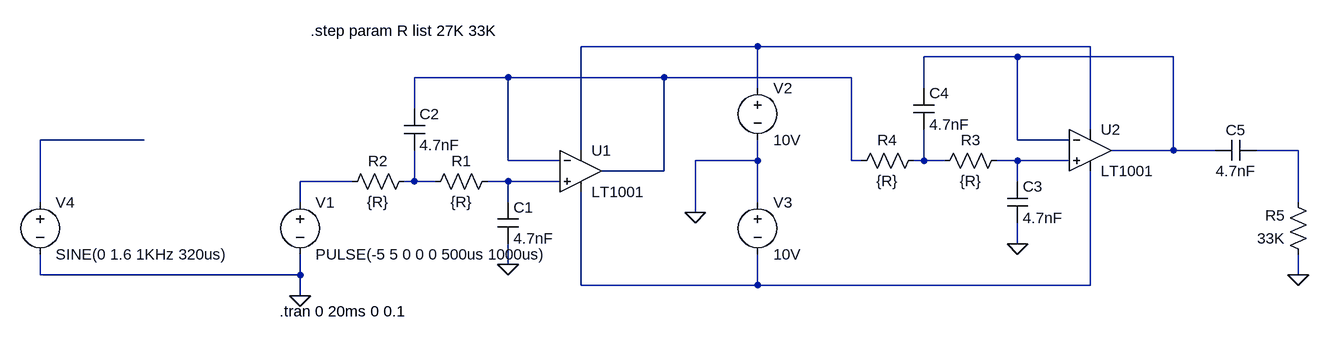
[diagram p0: schematic lpf_4_butterworth.asc]
lpf_4_butterworth.asc, the LTspice schematic file:
Version 4
SHEET 1 1364 680
WIRE 512 -32 240 -32
WIRE 1024 -32 512 -32
WIRE 912 -16 768 -16
WIRE 1152 -16 912 -16
WIRE 128 16 -16 16
WIRE 368 16 128 16
WIRE 656 16 368 16
WIRE 512 32 512 -32
WIRE 768 32 768 -16
WIRE -16 64 -16 16
WIRE 1024 96 1024 -32
WIRE -432 112 -592 112
WIRE 912 112 912 -16
WIRE 992 112 912 112
WIRE 240 128 240 -32
WIRE 1152 128 1152 -16
WIRE 1152 128 1056 128
WIRE 1216 128 1152 128
WIRE 1344 128 1280 128
WIRE 128 144 128 16
WIRE 208 144 128 144
WIRE 512 144 512 112
WIRE 512 144 416 144
WIRE 656 144 656 16
WIRE 672 144 656 144
WIRE 768 144 768 96
WIRE 768 144 752 144
WIRE 800 144 768 144
WIRE 912 144 880 144
WIRE 992 144 912 144
WIRE 368 160 368 16
WIRE 368 160 272 160
WIRE -112 176 -192 176
WIRE -16 176 -16 128
WIRE -16 176 -32 176
WIRE 16 176 -16 176
WIRE 128 176 96 176
WIRE 208 176 128 176
WIRE 912 176 912 144
WIRE -592 208 -592 112
WIRE -192 208 -192 176
WIRE 128 208 128 176
WIRE 512 208 512 144
WIRE 1344 208 1344 128
WIRE 416 224 416 144
WIRE 912 272 912 240
WIRE 128 304 128 272
WIRE -592 320 -592 288
WIRE -192 320 -192 288
WIRE -192 320 -592 320
WIRE 1344 320 1344 288
WIRE 240 336 240 192
WIRE 512 336 512 288
WIRE 512 336 240 336
WIRE 1024 336 1024 160
WIRE 1024 336 512 336
WIRE -192 352 -192 320
FLAG 128 304 0
FLAG -192 352 0
FLAG 416 224 0
FLAG 912 272 0
FLAG 1344 320 0
SYMBOL cap 112 208 R0
SYMATTR InstName C1
SYMATTR Value 4.7nF
SYMBOL res 112 160 R90
WINDOW 0 0 56 VBottom 2
WINDOW 3 32 56 VTop 2
SYMATTR InstName R1
SYMATTR Value {R}
SYMBOL res -16 160 R90
WINDOW 0 0 56 VBottom 2
WINDOW 3 32 56 VTop 2
SYMATTR InstName R2
SYMATTR Value {R}
SYMBOL cap -32 64 R0
SYMATTR InstName C2
SYMATTR Value 4.7nF
SYMBOL voltage -192 192 R0
WINDOW 123 0 0 Left 2
WINDOW 39 0 0 Left 2
SYMATTR InstName V1
SYMATTR Value PULSE(-5 5 0 0 0 500us 1000us)
SYMBOL voltage 512 16 R0
WINDOW 123 0 0 Left 2
WINDOW 39 0 0 Left 2
SYMATTR InstName V2
SYMATTR Value 10V
SYMBOL voltage 512 192 R0
WINDOW 123 0 0 Left 2
WINDOW 39 0 0 Left 2
SYMATTR InstName V3
SYMATTR Value 10V
SYMBOL Opamps\\LT1001 240 96 R0
SYMATTR InstName U1
SYMBOL voltage -592 192 R0
WINDOW 123 0 0 Left 2
WINDOW 39 0 0 Left 2
SYMATTR InstName V4
SYMATTR Value SINE(0 1.6 1KHz 320us)
SYMBOL cap 896 176 R0
SYMATTR InstName C3
SYMATTR Value 4.7nF
SYMBOL res 896 128 R90
WINDOW 0 0 56 VBottom 2
WINDOW 3 32 56 VTop 2
SYMATTR InstName R3
SYMATTR Value {R}
SYMBOL res 768 128 R90
WINDOW 0 0 56 VBottom 2
WINDOW 3 32 56 VTop 2
SYMATTR InstName R4
SYMATTR Value {R}
SYMBOL cap 752 32 R0
SYMATTR InstName C4
SYMATTR Value 4.7nF
SYMBOL Opamps\\LT1001 1024 64 R0
SYMATTR InstName U2
SYMBOL cap 1280 112 R90
WINDOW 0 0 32 VBottom 2
WINDOW 3 32 32 VTop 2
SYMATTR InstName C5
SYMATTR Value 4.7nF
SYMBOL res 1360 304 R180
WINDOW 0 36 76 Left 2
WINDOW 3 36 40 Left 2
SYMATTR InstName R5
SYMATTR Value 33K
TEXT -224 376 Left 2 !.tran 0 20ms 0 0.1
TEXT -176 -56 Left 2 !.step param R list 27K 33K

The netlist it stands for:
* lpf_4_butterworth.asc
C1 N010 0 4.7nF
R1 N010 N009 {R}
R2 N009 N008 {R}
C2 N003 N009 4.7nF
V1 N008 0 PULSE(-5 5 0 0 0 500us 1000us)
V2 N001 0 10V
V3 0 N011 10V
XU1 N010 N003 N001 N011 N003 LT1001  ; pins In+ In- V+ V- OUT
V4 N004 0 SINE(0 1.6 1KHz 320us)
C3 N007 0 4.7nF
R3 N007 N006 {R}
R4 N006 N003 {R}
C4 N002 N006 4.7nF
XU2 N007 N002 N001 N011 N002 LT1001  ; pins In+ In- V+ V- OUT
C5 N005 N002 4.7nF
R5 0 N005 33K
.tran 0 20ms 0 0.1
.step param R list 27K 33K
.lib LTC.lib
.backanno
.end